# Altium schematic sheet SIM_slots_2.SchDoc
size A3
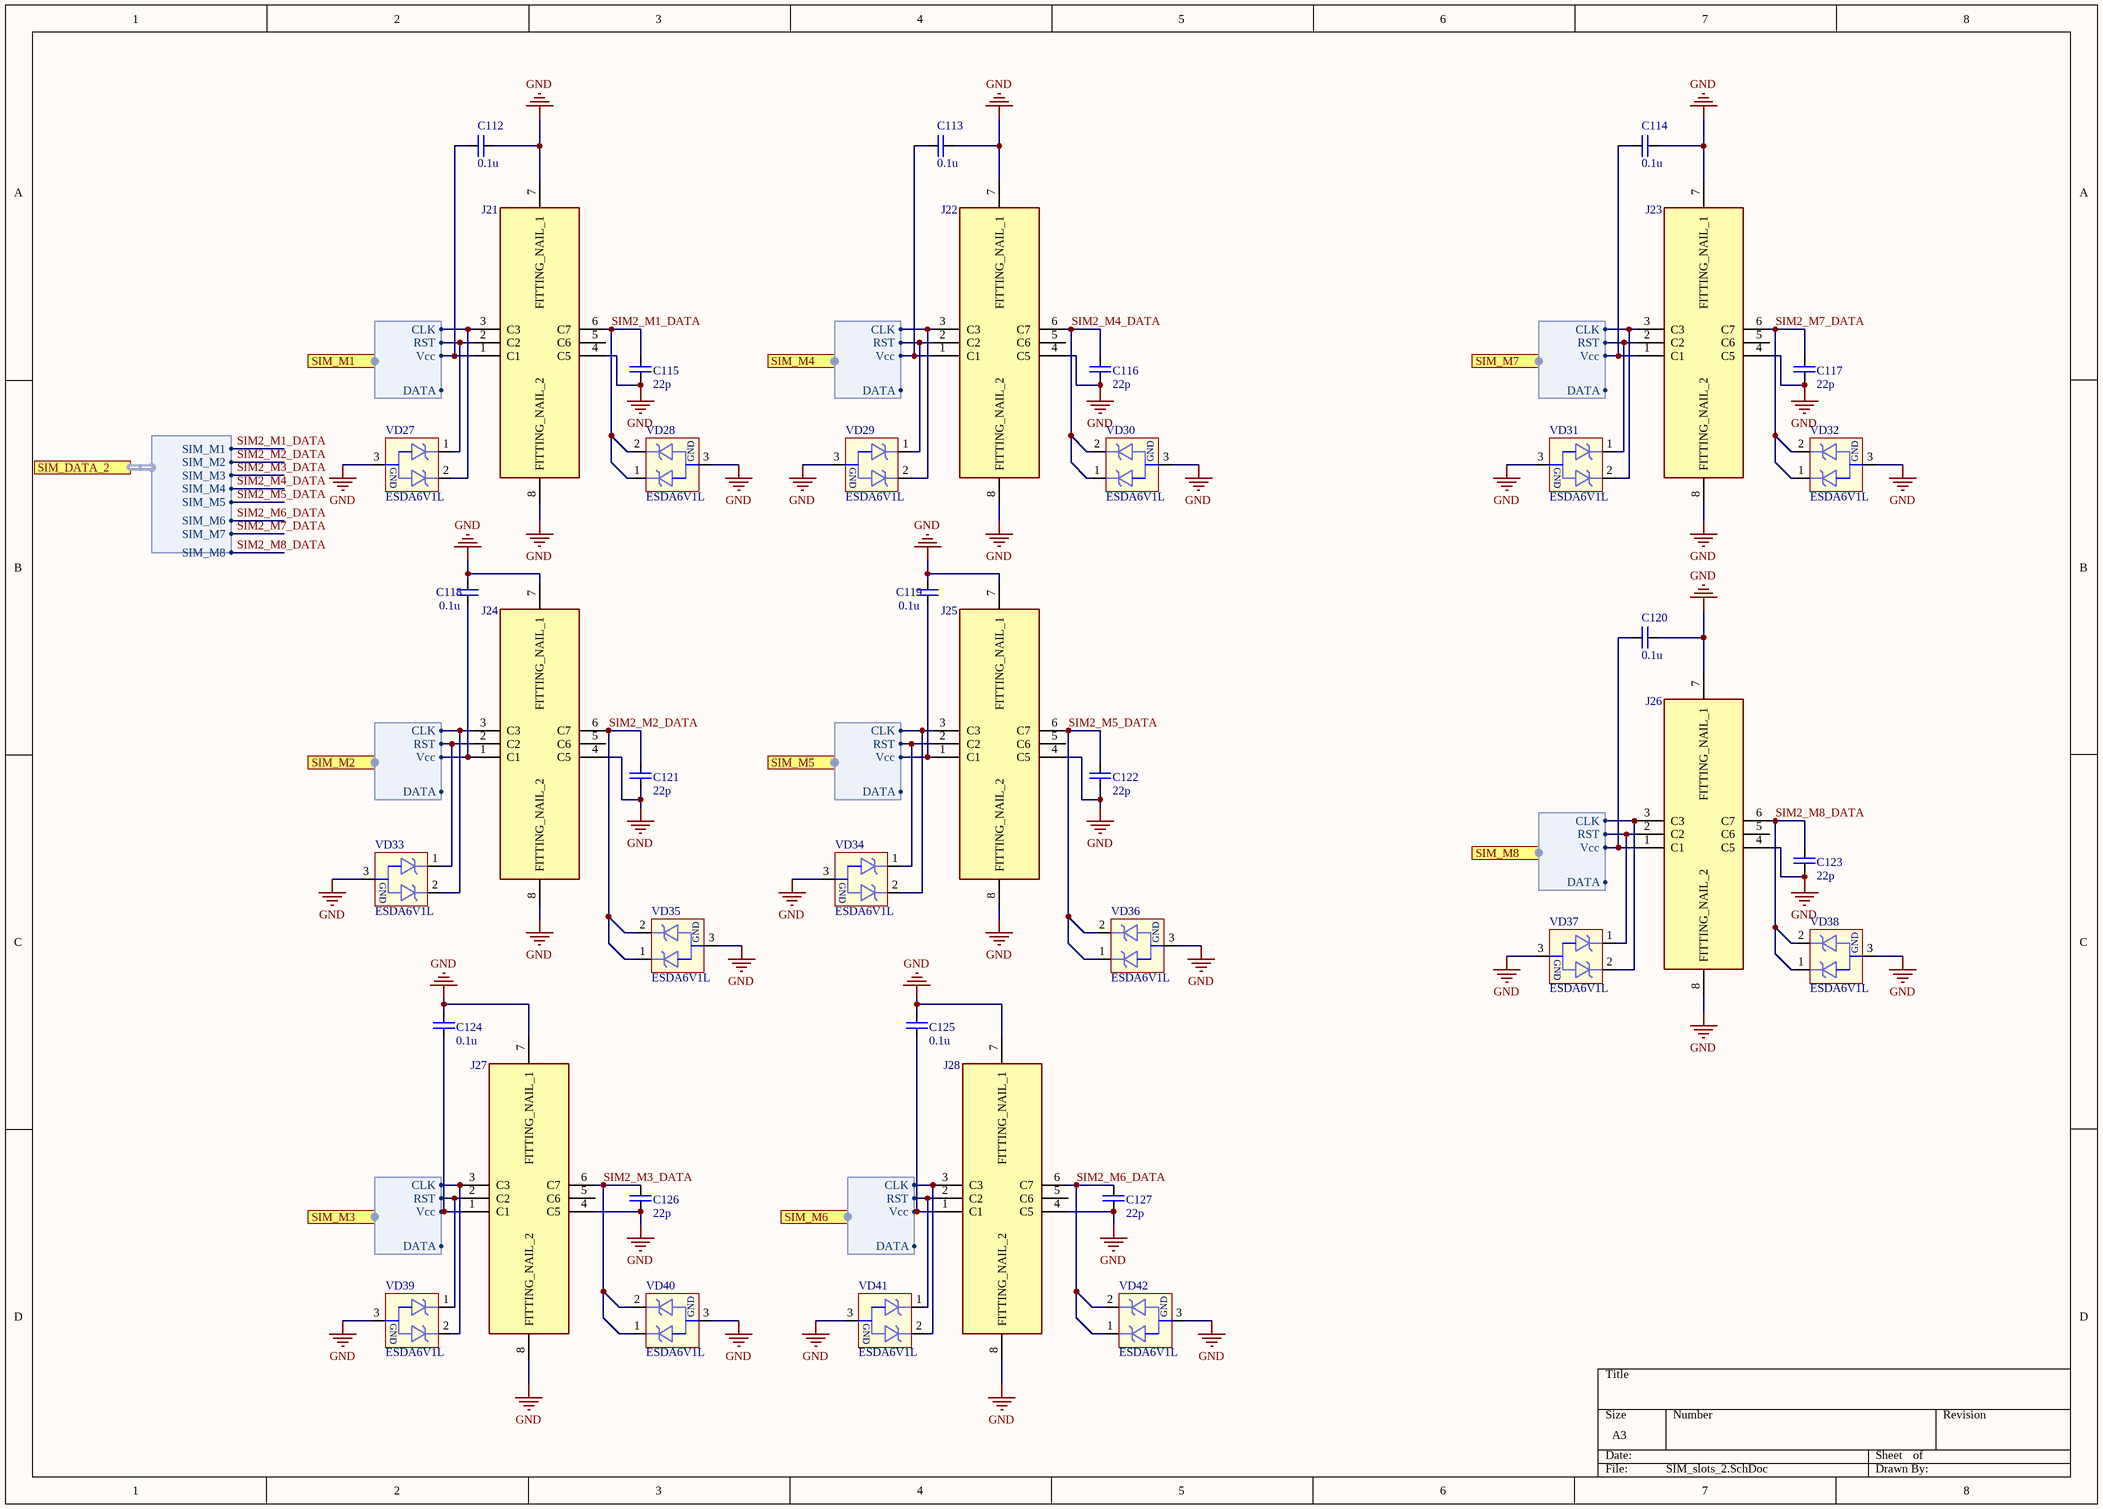
[diagram p0: SIM_slots_2.SchDoc]

## Parts
C112  value 0.1u  [C0402]  (hidden comment: Конденсатор SMD, 0.1мкФ, X7R, 25В, 10%, 0402)
C113  value 0.1u  [C0402]  (hidden comment: Конденсатор SMD, 0.1мкФ, X7R, 25В, 10%, 0402)
C114  value 0.1u  [C0402]  (hidden comment: Конденсатор SMD, 0.1мкФ, X7R, 25В, 10%, 0402)
C115  value 22p  [C0402]  (hidden comment: Конденсатор SMD, 22пФ, X7R, 50В, 10%, 0402)
C116  value 22p  [C0402]  (hidden comment: Конденсатор SMD, 22пФ, X7R, 50В, 10%, 0402)
C117  value 22p  [C0402]  (hidden comment: Конденсатор SMD, 22пФ, X7R, 50В, 10%, 0402)
C118  value 0.1u  [C0402]  (hidden comment: Конденсатор SMD, 0.1мкФ, X7R, 25В, 10%, 0402)
C119  value 0.1u  [C0402]  (hidden comment: Конденсатор SMD, 0.1мкФ, X7R, 25В, 10%, 0402)
C120  value 0.1u  [C0402]  (hidden comment: Конденсатор SMD, 0.1мкФ, X7R, 25В, 10%, 0402)
C121  value 22p  [C0402]  (hidden comment: Конденсатор SMD, 22пФ, X7R, 50В, 10%, 0402)
C122  value 22p  [C0402]  (hidden comment: Конденсатор SMD, 22пФ, X7R, 50В, 10%, 0402)
C123  value 22p  [C0402]  (hidden comment: Конденсатор SMD, 22пФ, X7R, 50В, 10%, 0402)
C124  value 0.1u  [C0402]  (hidden comment: Конденсатор SMD, 0.1мкФ, X7R, 25В, 10%, 0402)
C125  value 0.1u  [C0402]  (hidden comment: Конденсатор SMD, 0.1мкФ, X7R, 25В, 10%, 0402)
C126  value 22p  [C0402]  (hidden comment: Конденсатор SMD, 22пФ, X7R, 50В, 10%, 0402)
C127  value 22p  [C0402]  (hidden comment: Конденсатор SMD, 22пФ, X7R, 50В, 10%, 0402)
J21  47388-2001  [473882001]  (value not drawn)
J22  47388-2001  [473882001]  (value not drawn)
J23  47388-2001  [473882001]  (value not drawn)
J24  47388-2001  [473882001]  (value not drawn)
J25  47388-2001  [473882001]  (value not drawn)
J26  47388-2001  [473882001]  (value not drawn)
J27  47388-2001  [473882001]  (value not drawn)
J28  47388-2001  [473882001]  (value not drawn)
VD27  Диод защитный, ESDA6V1L  [SOT23-3L]  (value not drawn)
VD28  Диод защитный, ESDA6V1L  [SOT23-3L]  (value not drawn)
VD29  Диод защитный, ESDA6V1L  [SOT23-3L]  (value not drawn)
VD30  Диод защитный, ESDA6V1L  [SOT23-3L]  (value not drawn)
VD31  Диод защитный, ESDA6V1L  [SOT23-3L]  (value not drawn)
VD32  Диод защитный, ESDA6V1L  [SOT23-3L]  (value not drawn)
VD33  Диод защитный, ESDA6V1L  [SOT23-3L]  (value not drawn)
VD34  Диод защитный, ESDA6V1L  [SOT23-3L]  (value not drawn)
VD35  Диод защитный, ESDA6V1L  [SOT23-3L]  (value not drawn)
VD36  Диод защитный, ESDA6V1L  [SOT23-3L]  (value not drawn)
VD37  Диод защитный, ESDA6V1L  [SOT23-3L]  (value not drawn)
VD38  Диод защитный, ESDA6V1L  [SOT23-3L]  (value not drawn)
VD39  Диод защитный, ESDA6V1L  [SOT23-3L]  (value not drawn)
VD40  Диод защитный, ESDA6V1L  [SOT23-3L]  (value not drawn)
VD41  Диод защитный, ESDA6V1L  [SOT23-3L]  (value not drawn)
VD42  Диод защитный, ESDA6V1L  [SOT23-3L]  (value not drawn)

## Ports
SIM_DATA_2 (harness SIM_DATA), SIM_M1 (harness SIM), SIM_M2 (harness SIM), SIM_M3 (harness SIM), SIM_M4 (harness SIM), SIM_M5 (harness SIM), SIM_M6 (harness SIM), SIM_M7 (harness SIM), SIM_M8 (harness SIM)

## Harnesses
SIM: Vcc, RST, CLK, DATA
SIM_DATA: SIM_M1, SIM_M2, SIM_M3, SIM_M4, SIM_M5, SIM_M6, SIM_M7, SIM_M8

## Nets
GND: C112.2 C113.2 C114.2 C115.1 C116.1 C117.1 C118.2 C119.2 C120.2 C121.1 C122.1 C123.1 C124.2 C125.2 C126.1 C127.1 J21.4(C5) J21.7(FITTING_NAIL_1) J21.8(FITTING_NAIL_2) J22.4(C5) J22.7(FITTING_NAIL_1) J22.8(FITTING_NAIL_2) J23.4(C5) J23.7(FITTING_NAIL_1) J23.8(FITTING_NAIL_2) J24.4(C5) J24.7(FITTING_NAIL_1) J24.8(FITTING_NAIL_2) J25.4(C5) J25.7(FITTING_NAIL_1) J25.8(FITTING_NAIL_2) J26.4(C5) J26.7(FITTING_NAIL_1) J26.8(FITTING_NAIL_2) J27.4(C5) J27.7(FITTING_NAIL_1) J27.8(FITTING_NAIL_2) J28.4(C5) J28.7(FITTING_NAIL_1) J28.8(FITTING_NAIL_2) VD27.3(GND) VD28.3(GND) VD29.3(GND) VD30.3(GND) VD31.3(GND) VD32.3(GND) VD33.3(GND) VD34.3(GND) VD35.3(GND) VD36.3(GND) VD37.3(GND) VD38.3(GND) VD39.3(GND) VD40.3(GND) VD41.3(GND) VD42.3(GND)
SIM2_M1_DATA: C115.2 J21.6(C7) VD28.1 VD28.2 ; port SIM_DATA_2.SIM_M1
SIM2_M2_DATA: C121.2 J24.6(C7) VD35.1 VD35.2 ; port SIM_DATA_2.SIM_M2
SIM2_M3_DATA: C126.2 J27.6(C7) VD40.1 VD40.2 ; port SIM_DATA_2.SIM_M3
SIM2_M4_DATA: C116.2 J22.6(C7) VD30.1 VD30.2 ; port SIM_DATA_2.SIM_M4
SIM2_M5_DATA: C122.2 J25.6(C7) VD36.1 VD36.2 ; port SIM_DATA_2.SIM_M5
SIM2_M6_DATA: C127.2 J28.6(C7) VD42.1 VD42.2 ; port SIM_DATA_2.SIM_M6
SIM2_M7_DATA: C117.2 J23.6(C7) VD32.1 VD32.2 ; port SIM_DATA_2.SIM_M7
SIM2_M8_DATA: C123.2 J26.6(C7) VD38.1 VD38.2 ; port SIM_DATA_2.SIM_M8
NetC112_1: C112.1 J21.1(C1) ; port SIM_M1.Vcc
NetC113_1: C113.1 J22.1(C1) ; port SIM_M4.Vcc
NetC114_1: C114.1 J23.1(C1) ; port SIM_M7.Vcc
NetC118_1: C118.1 J24.1(C1) ; port SIM_M2.Vcc
NetC119_1: C119.1 J25.1(C1) ; port SIM_M5.Vcc
NetC120_1: C120.1 J26.1(C1) ; port SIM_M8.Vcc
NetC124_1: C124.1 J27.1(C1) ; port SIM_M3.Vcc
NetC125_1: C125.1 J28.1(C1) ; port SIM_M6.Vcc
NetJ21_2: J21.2(C2) VD27.1 ; port SIM_M1.RST
NetJ21_3: J21.3(C3) VD27.2 ; port SIM_M1.CLK
NetJ22_2: J22.2(C2) VD29.1 ; port SIM_M4.RST
NetJ22_3: J22.3(C3) VD29.2 ; port SIM_M4.CLK
NetJ23_2: J23.2(C2) VD31.1 ; port SIM_M7.RST
NetJ23_3: J23.3(C3) VD31.2 ; port SIM_M7.CLK
NetJ24_2: J24.2(C2) VD33.1 ; port SIM_M2.RST
NetJ24_3: J24.3(C3) VD33.2 ; port SIM_M2.CLK
NetJ25_2: J25.2(C2) VD34.1 ; port SIM_M5.RST
NetJ25_3: J25.3(C3) VD34.2 ; port SIM_M5.CLK
NetJ26_2: J26.2(C2) VD37.1 ; port SIM_M8.RST
NetJ26_3: J26.3(C3) VD37.2 ; port SIM_M8.CLK
NetJ27_2: J27.2(C2) VD39.1 ; port SIM_M3.RST
NetJ27_3: J27.3(C3) VD39.2 ; port SIM_M3.CLK
NetJ28_2: J28.2(C2) VD41.1 ; port SIM_M6.RST
NetJ28_3: J28.3(C3) VD41.2 ; port SIM_M6.CLK

Not connected (* = marked no-connect by the designer): J21 5(C6); J22 5(C6); J23 5(C6); J24 5(C6); J25 5(C6); J26 5(C6); J27 5(C6); J28 5(C6)

## Library data of the parts
C112-C114 C118-C120 C124 C125 = C0402: Chip Capacitor 0402; Assembly: 0.1u_X7R_25V_10%_0402; Voltage_assembly: 25V; Tolerance: 10%; Voltage: 25В; TemperatureCoeff: X7R; Family: Конденсатор SMD; Capacitance: 0.1мкФ; Package: 0402
C115-C117 C121-C123 C126 C127 = C0402: Chip Capacitor 0402; Assembly: 22p_X7R_50V_10%_0402; Voltage_assembly: 50V; Tolerance: 10%; Voltage: 50В; TemperatureCoeff: X7R; Family: Конденсатор SMD; Capacitance: 22пФ; Package: 0402
J21-J28 = 47388-2001: Connector; Manufacturer_Name: Molex; Datasheet Link: https://www.molex.com/webdocs/datasheets/pdf/en-us/0473882001_MEMORY_CARD_SOCKET.pdf; Height: 1mm; Manufacturer_Part_Number: 47388-2001; Arrow Part Number: 47388-2001; Arrow Price/Stock: https://www.arrow.com/en/products/47388-2001/molex; Mouser Part Number: 538-47388-2001; Mouser Price/Stock: https://www.mouser.co.uk/ProductDetail/Molex/47388-2001?qs=KKUMDL8WE1K2q3cPEOwmLw%3D%3D
VD27-VD42 = ESDA6V1L: Dual diode array for ESD protection; Manufacturer: STMicroelectronics; Family: Диод защитный; Package: SOT23; Assembly: ESDA6V1L; PartNumber: ESDA6V1L